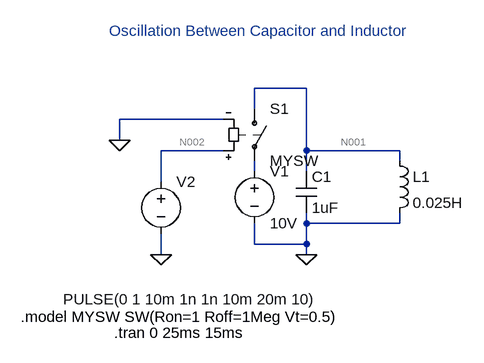
[diagram p0: schematic ideal_oscillations.asc]
ideal_oscillations.asc, the LTspice schematic file:
Version 4.1
SHEET 1 880 680
WIRE 240 16 160 16
WIRE 160 48 160 16
WIRE 112 64 -48 64
WIRE -48 96 -48 64
WIRE 112 112 16 112
WIRE 240 112 240 16
WIRE 384 112 240 112
WIRE 384 128 384 112
WIRE 160 144 160 128
WIRE 240 144 240 112
WIRE 16 160 16 112
WIRE 240 224 240 208
WIRE 384 224 384 208
WIRE 384 224 240 224
WIRE 160 256 160 224
WIRE 240 256 240 224
WIRE 240 256 160 256
WIRE 16 272 16 240
WIRE 240 272 240 256
FLAG 240 272 0
FLAG -48 96 0
FLAG 16 272 0
SYMBOL cap 224 144 R0
SYMATTR InstName C1
SYMATTR Value 1uF
SYMBOL ind 368 112 R0
SYMATTR InstName L1
SYMATTR Value 0.025H
SYMBOL voltage 160 128 R0
WINDOW 123 0 0 Left 0
WINDOW 39 0 0 Left 0
SYMATTR InstName V1
SYMATTR Value 10V
SYMBOL sw 160 32 R0
SYMATTR InstName S1
SYMATTR Value MYSW
SYMBOL voltage 16 144 R0
WINDOW 3 -151 197 Left 2
WINDOW 123 0 0 Left 0
WINDOW 39 0 0 Left 0
SYMATTR Value PULSE(0 1 10m 1n 1n 10m 20m 10)
SYMATTR InstName V2
TEXT -56 392 Left 2 !.tran 0 25ms 15ms
TEXT -200 368 Left 2 !.model MYSW SW(Ron=1 Roff=1Meg Vt=0.5)
TEXT -64 -72 Left 2 ;Oscillation Between Capacitor and Inductor

The netlist it stands for:
* ideal_oscillations.asc
C1 N001 0 1uF
L1 N001 0 0.025H
V1 N003 0 10V
S1 N001 N003 N002 0 MYSW
V2 N002 0 PULSE(0 1 10m 1n 1n 10m 20m 10)
.tran 0 25ms 15ms
.model MYSW SW(Ron=1 Roff=1Meg Vt=0.5)
* Oscillation Between Capacitor and Inductor
.backanno
.end

* Results of the author's LTspice run, read from the files saved beside the schematic
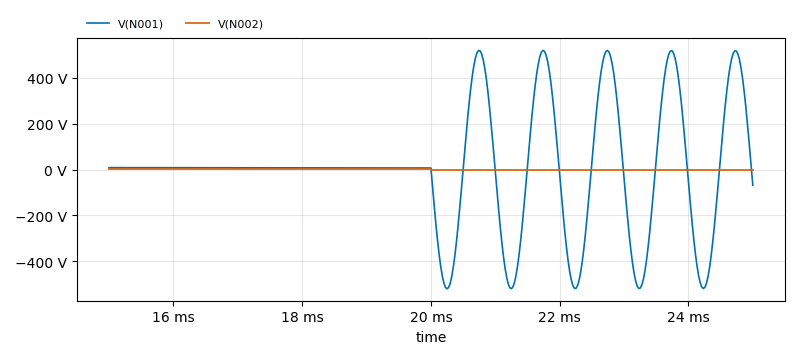
[diagram p1: Transient Analysis of ideal_oscillations.asc, plotted from the saved traces]
* Transient Analysis, 1 run:
*   V(N001): min -521.1 V, max 520.6 V, average 3.622 V, rms 259.7 V, last -68.31 V
*   V(N002): min 0 V, max 1 V, average 500 mV, rms 707.1 mV, last 0 V